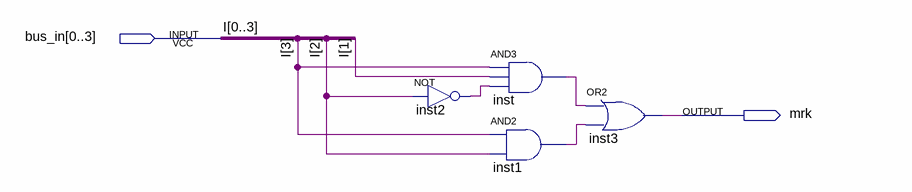
[diagram p0: schematic sheet]
// Quartus schematic MRK_not_chislo.bdf as structural Verilog: 4 symbols, 2 pins
module MRK_not_chislo (
  input  [0:3] bus_in,
  output mrk
);

  wire inst1_out, inst2_out, inst_out;

  not inst2 (inst2_out, bus_in[2]);
  and inst (inst_out, bus_in[3], bus_in[1], inst2_out);
  and inst1 (inst1_out, bus_in[3], bus_in[2]);
  or inst3 (mrk, inst_out, inst1_out);

  // Other names for the same wires on the sheet: I[3:0] = {bus_in[3], bus_in[2], bus_in[1], bus_in[0]}
endmodule
